# EAGLE design uC_Main 3 (EAGLE 8.5.0)
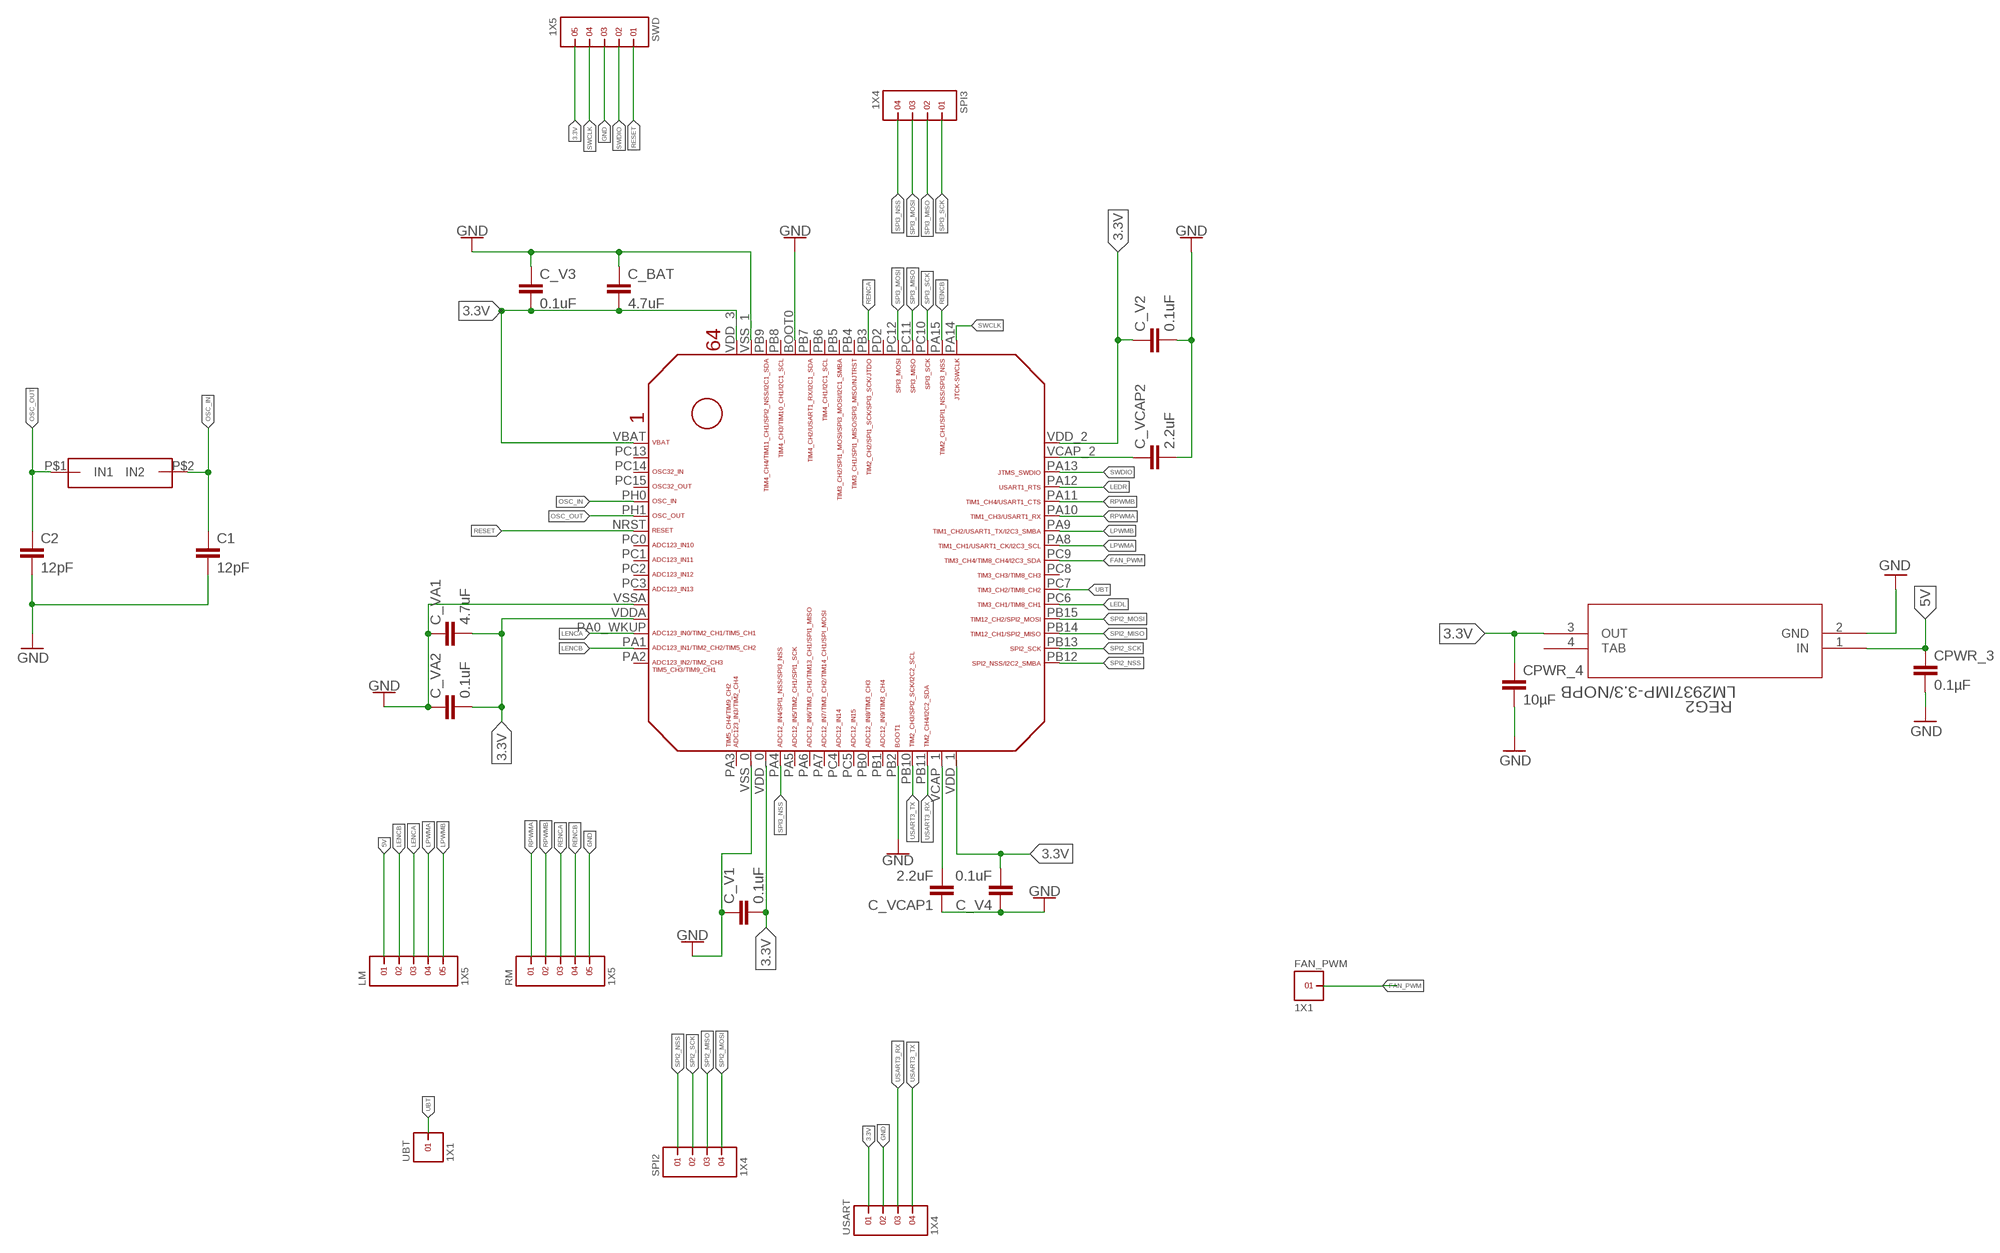
[diagram p0: schematic, sheet 1]

## Parts
C1  12pF  22PF-0603-50V-5%  [0603]
C2  12pF  22PF-0603-50V-5%  [0603]
C_BAT  4.7uF  22UF-0805-6.3V-20%  [0805@1]
C_V1  0.1uF  22UF-0805-6.3V-20%  [0805@1]
C_V2  0.1uF  22UF-0805-6.3V-20%  [0805@1]
C_V3  0.1uF  22UF-0805-6.3V-20%  [0805@1]
C_V4  0.1uF  22UF-0805-6.3V-20%  [0805@1]
C_VA1  4.7uF  22UF-0805-6.3V-20%  [0805@1]
C_VA2  0.1uF  22UF-0805-6.3V-20%  [0805@1]
C_VCAP1  2.2uF  22UF-0805-6.3V-20%  [0805@1]
C_VCAP2  2.2uF  22UF-0805-6.3V-20%  [0805@1]
CPWR_3  0.1µF  0.33UF/330NF-0805-50V-10%  [0805]
CPWR_4  10µF  0.33UF/330NF-0805-50V-10%  [0805]
FAN_PWM  1X1  [1X1]
LM  1X5  [1X5]
REG2  LM2937IMP-3.3/NOPB  [MP04A]
RM  1X5  [1X5]
SPI2  1X4  [1X4]
SPI3  1X4  [1X4]
SWD  1X5  [1X5]
U$1  STM32F405/415_LQFP64  [STM32F405/415_LQFP64]
U$2  OSC  [OSC]
UBT  1X1  [1X1]
USART  1X4  [1X4]

## Nets
3.3V: C_BAT.2 C_V1.2 C_V2.1 C_V3.2 C_V4.2 C_VA1.2 C_VA2.2 CPWR_4.1 REG2.3(OUT) SWD.5 U$1.VBAT U$1.VDD_0 U$1.VDD_1 U$1.VDD_2 U$1.VDD_3 U$1.VDDA USART.1
5V: CPWR_3.1 LM.1 REG2.1(IN)
FAN_PWM: FAN_PWM.1 U$1.PC9
GND: C1.2 C2.2 C_BAT.1 C_V1.1 C_V2.2 C_V3.1 C_V4.1 C_VA1.1 C_VA2.1 C_VCAP1.1 C_VCAP2.2 CPWR_3.2 CPWR_4.2 REG2.2(GND) RM.5 SWD.3 U$1.BOOT0 U$1.PB2 U$1.VSS_0 U$1.VSS_1 U$1.VSSA USART.2
LEDL: U$1.PC6
LEDR: U$1.PA12
LENCA: LM.3 U$1.PA0_WKUP(PA0_AKUP)
LENCB: LM.2 U$1.PA1
LPWMA: LM.4 U$1.PA8
LPWMB: LM.5 U$1.PA9
OSC_IN: C1.1 U$1.PH0 U$2.P$2(IN2)
OSC_OUT: C2.1 U$1.PH1 U$2.P$1(IN1)
RENCA: RM.3 U$1.PB3
RENCB: RM.4 U$1.PA15
RESET: SWD.1 U$1.NRST
RPWMA: RM.1 U$1.PA10
RPWMB: RM.2 U$1.PA11
SPI2_MISO: SPI2.3 U$1.PB14
SPI2_MOSI: SPI2.4 U$1.PB15
SPI2_NSS: SPI2.1 U$1.PB12
SPI2_SCK: SPI2.2 U$1.PB13
SPI3_MISO: SPI3.2 U$1.PC11
SPI3_MOSI: SPI3.3 U$1.PC12
SPI3_NSS: SPI3.4 U$1.PA4
SPI3_SCK: SPI3.1 U$1.PC10
SWCLK: SWD.4 U$1.PA14
SWDIO: SWD.2 U$1.PA13
UBT: U$1.PC7 UBT.1
USART3_RX: U$1.PB11 USART.3
USART3_TX: U$1.PB10 USART.4
VCAP_1: C_VCAP1.2 U$1.VCAP_1
VCAP_2: C_VCAP2.1 U$1.VCAP_2
Unconnected: U$1.PA2 U$1.PA3 U$1.PA5 U$1.PA6 U$1.PA7 U$1.PB0 U$1.PB1 U$1.PB4 U$1.PB5 U$1.PB6 U$1.PB7 U$1.PB8 U$1.PB9 U$1.PC0 U$1.PC1 U$1.PC2 U$1.PC3 U$1.PC4 U$1.PC5 U$1.PC8 U$1.PC13 U$1.PC14 U$1.PC15 U$1.PD2

## Power pins joined to a net without a drawn wire
TAB: REG2.4(TAB)

## Library data of the parts
C1 C2 = SparkFun-Capacitors:22PF: 22pF ceramic capacitors A capacitor is a passive two-terminal electrical component used to store electrical energy temporarily in an electric field.; PROD_ID: CAP-07876; VALUE: 22pF
C_BAT C_V1-C_V4 C_VA1 C_VA2 C_VCAP1 C_VCAP2 = SparkFun-Capacitors:22UF: 22µF ceramic capacitors A capacitor is a passive two-terminal electrical component used to store electrical energy temporarily in an electric field.; PROD_ID: CAP-08402; VALUE: 22uF
CPWR_3 CPWR_4 = SparkFun-Capacitors:0.33UF/330NF: 0.33¦ÌF/330nF ceramic capacitors A capacitor is a passive two-terminal electrical component used to store electrical energy temporarily in an electric field.; PROD_ID: CAP-08469; VALUE: 0.33¦ÌF
FAN_PWM UBT = headers(2mm):1X1
LM RM SWD = headers(2mm):1X5
REG2 = LM2937IMP-3.3:LM2937IMP-3.3/NOPB; COPYRIGHT: Copyright C 2015 Accelerated Designs. All rights reserved; MANUFACTURER_PART_NUMBER: lm2937imp3_3nopb; VENDOR: National Semiconductor
SPI2 SPI3 USART = headers(2mm):1X4
U$1 = STM32F405RG:STM32F405/415_LQFP64
U$2 = Cristal Oscillator:OSC

## Board
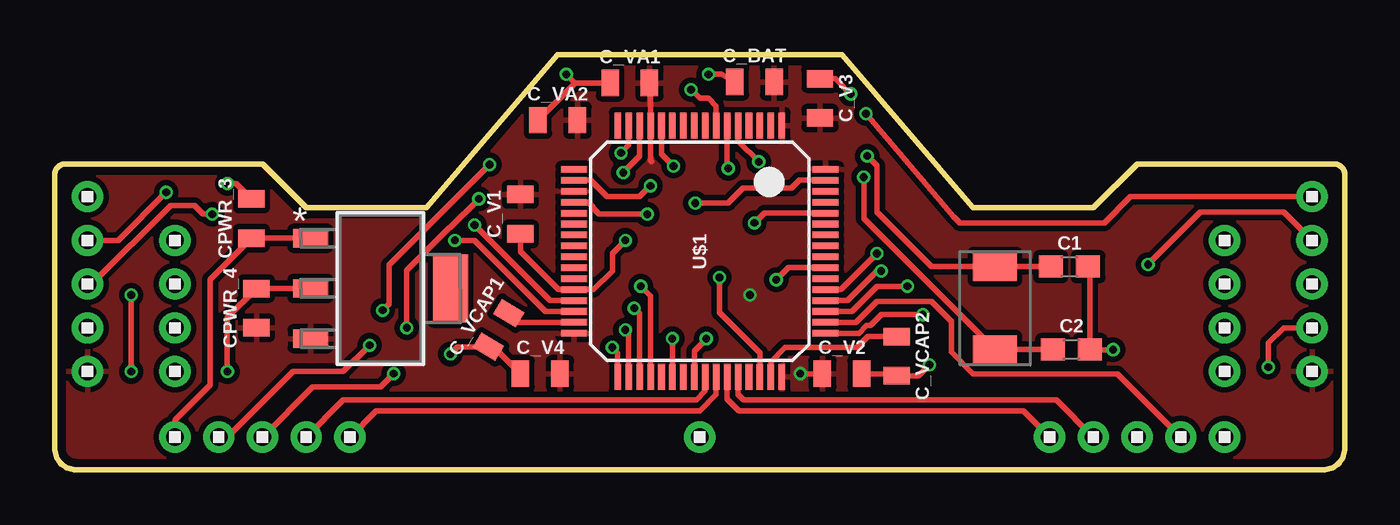
[diagram p1: board, top side]
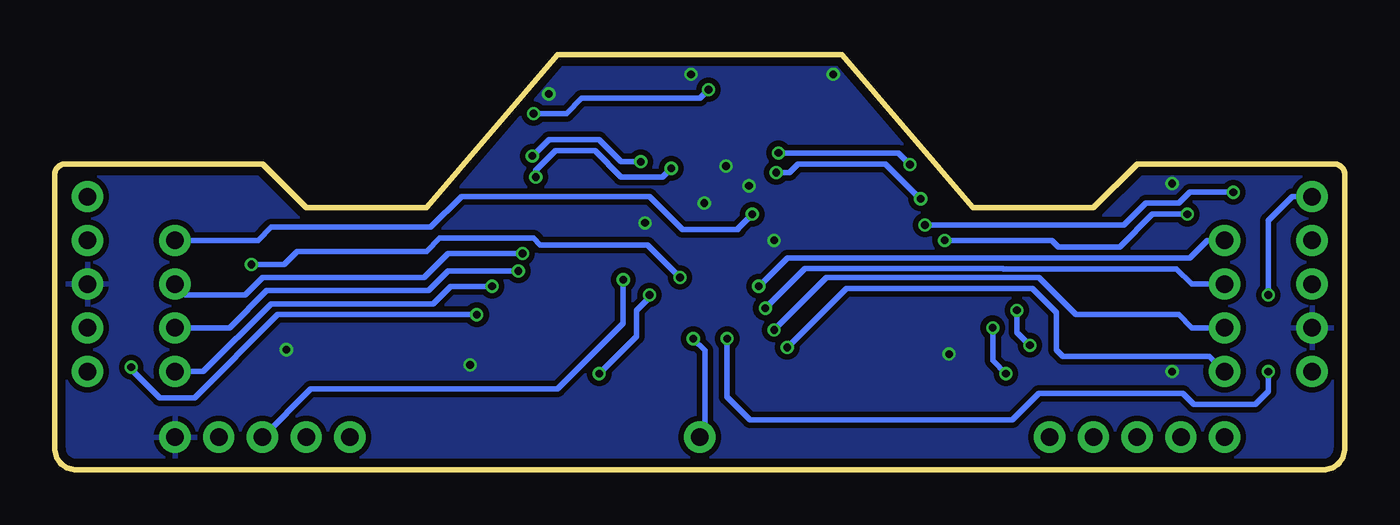
[diagram p2: board, bottom side, seen from below]

Size 59 x 19 mm. Coordinates in mm from the lower left corner, seen from the top.
Outline: 0.9,0 1,0
Outline: 1,0 58,0 arc90 59,1 59,13.5 arc90 58.5,14 49.5,14 47.5,12 42,12 36,19 23,19 17,12 11.5,12 9.5,14 0.5,14 arc90 0,13.5 0,1 arc90 1,0
Copper layers (1*16): Top 0.035559375mm / dielectric 1.6mm / Bottom 0.035559375mm
Design rules "oshpark-2layer *": minimum track width 6mil, minimum drill 10mil, track to track 6mil, track to pad 6mil, pad to pad 6mil, via to via 6mil, smd to smd 6mil, copper to edge 15mil, drill to drill 6mil, minimum pad ring 5mil, minimum via ring 5mil, stop-mask expansion 0mil, vias tented up to drill 12mil, thermal gap 10mil

### Footprints (pad centres in the part's own frame; a part is rotated, then mirrored left to right if it is on the bottom)
0603 = smd 1.1 x 1: 1 -0.85,0; 2 0.85,0
0805@1 = smd 0.8 x 1.2: 1 -0.9,0; 2 0.9,0
0805 = smd 0.8 x 1.2: 1 -0.9,0; 2 0.9,0
1X1 = drill 0.8 pad 1.422: 1 0,0
1X5 = drill 0.8 pad 1.422: 1 -4,0; 2 -2,0; 3 0,0; 4 2,0; 5 4,0
MP04A = smd 1.6 x 0.838: 1 -3.2,2.3; 2 -3.2,0; 3 -3.2,-2.3 | smd 1.6 x 3.099: 4 3.2,0
1X4 = drill 0.8 pad 1.422: 1 -3,0; 2 -1,0; 3 1,0; 4 3,0
STM32F405/415_LQFP64 = smd 0.3 x 1.2: BOOT0 -1.75,5.75; PA3 -3.75,-5.75; PA4 -2.25,-5.75; PA5 -1.75,-5.75; PA6 -1.25,-5.75; PA7 -0.75,-5.75; PA14 3.75,5.75; PA15 3.25,5.75; PB0 0.75,-5.75; PB1 1.25,-5.75; PB2 1.75,-5.75; PB3 0.75,5.75; PB4 0.25,5.75; PB5 -0.25,5.75; PB6 -0.75,5.75; PB7 -1.25,5.75; PB8 -2.25,5.75; PB9 -2.75,5.75; PB10 2.25,-5.75; PB11 2.75,-5.75; PC4 -0.25,-5.75; PC5 0.25,-5.75; PC10 2.75,5.75; PC11 2.25,5.75; PC12 1.75,5.75; PD2 1.25,5.75; VCAP_1 3.25,-5.75; VDD_0 -2.75,-5.75; VDD_1 3.75,-5.75; VDD_3 -3.75,5.75; VSS_0 -3.25,-5.75; VSS_1 -3.25,5.75 | smd 1.2 x 0.3: NRST -5.75,0.75; PA0_WKUP -5.75,-2.75; PA1 -5.75,-3.25; PA2 -5.75,-3.75; PA8 5.75,0.25; PA9 5.75,0.75; PA10 5.75,1.25; PA11 5.75,1.75; PA12 5.75,2.25; PA13 5.75,2.75; PB12 5.75,-3.75; PB13 5.75,-3.25; PB14 5.75,-2.75; PB15 5.75,-2.25; PC0 -5.75,0.25; PC1 -5.75,-0.25; PC2 -5.75,-0.75; PC3 -5.75,-1.25; PC6 5.75,-1.75; PC7 5.75,-1.25; PC8 5.75,-0.75; PC9 5.75,-0.25; PC13 -5.75,3.25; PC14 -5.75,2.75; PC15 -5.75,2.25; PH0 -5.75,1.75; PH1 -5.75,1.25; VBAT -5.75,3.75; VCAP_2 5.75,3.25; VDD_2 5.75,3.75; VDDA -5.75,-2.25; VSSA -5.75,-1.75
OSC = smd 1.3 x 2: P$1 0,0.1; P$2 3.8,0.1

### Placement (x,y rotation side)
C1  46.4,9.3 0 top
C2  46.5,5.51 0 top
C_BAT  32,17.75 0 top
C_V1  21.3,11.7 90 top
C_V2  36,4.4 0 top
C_V3  35,17 270 top
C_V4  22.2,4.4 0 top
C_VA1  26.3,17.7 0 top
C_VA2  23,16 0 top
C_VCAP1  20.3,6.4 58.6 top
C_VCAP2  38.5,5.2 270 top
CPWR_3  9,11.5 90 top
CPWR_4  9.23,7.4 90 top
FAN_PWM  29.5,1.5 0 top
LM  9.5,1.5 0 top
REG2  14.9,8.3 0 top
RM  49.5,1.5 0 top
SPI2  5.5,7.5 90 top
SPI3  53.5,7.5 90 top
SWD  57.5,8.5 270 top
U$1  29.5,10 270 top
U$2  43.1,5.5 90 top
UBT  1.5,12.5 0 top
USART  1.5,7.5 90 top

### Tracks (layer width: path | path; a pad name or v marks a point on that pad's centre or on a via)
3.3V  (via drill 0.35)
  Top 0.254: C_VA1.2 27.25,17.35 U$1.VDDA 27.25,14.15 27.3,14.1 | C_V2.1 v34.1,4.4
  Bottom 0.254: v34.1,4.4 32.4,6.1 32.4,7.3 31.8,7.9 v31.8,8
  pour Top (isolate 0.254): -17.5,32.5 -17.5,-17.5 -12.5,-22.5 64.5,-22.5 68.5,-18.5 68.5,27.5 62,34 -16,34
5V
  Top 0.254: LM.1 5.5,2.3 7.1,3.9 7.1,8.7 CPWR_3.1 REG2.1
FAN_PWM  (via drill 0.35)
  Top 0.254: U$1.PC9 29.25,5.45 v29.8,6
  Bottom 0.254: FAN_PWM.1 29.5,1.95 29.26,2.19 29.26,5.46 v29.8,6
GND  (via drill 0.35)
  Top 0.254: C_V1.1 21.3,9.99 23.04,8.25 U$1.PB2 24.65,8.25 25.5,9.1 25.5,9.9 v26.1,10.5 | C_VA1.1 23.8,17.7 | 23.8,17.7 C_VA2.1 | 23.8,17.7 v23.4,18.1 | C_BAT.1 30.5,18.1 v29.9,18.1 | v18.1,5.3 18.43,5.63 C_VCAP1.1 20.07,5.63 C_V4.1 | U$1.BOOT0 32.45,11.75 v32,11.3 | C_V3.1 35.7,17.9 v36.4,17.2 | U$1.VSSA 27.75,14.45 v28.3,13.9 | C_V2.2 38.4,4.4 C_VCAP2.2 39.5,4.3 v40,4.8 | U$1.VSS_1 34.05,13.25 33.7,12.9 31.47,12.9 30.78,12.21 v29.29,12.21 | C1.2 47.35,9.2 C2.2 47.36,5.5 v48.4,5.5 | U$1.VSS_0 24.5,13.25 25.25,12.5 26.75,12.5 v27.25,13 | v7.9,4.5 7.9,6.97 CPWR_4.2 11.6,8.3 REG2.2 | REG2.2 | CPWR_3.2 8.3,13.1 v7.9,13.1 | REG2.2
  pour Bottom (isolate 0.254): -14,-20 -10,-24 58,-24 65,-17 65,30 64,31 -13.5,31 -14,30.5
LENCA  (via drill 0.35)
  Top 0.254: v26,13.6 26.75,14.35 U$1.PA0_WKUP | v19.4,12.4 18.08,11.08 18.06,11.08 16.1,9.12 v16.1,6.5 | v15.5,4.4 14.9,3.8 11.8,3.8 LM.3
  Bottom 0.254: v26,13.6 25.4,13.6 25,14 21,14 v19.4,12.4 | v16.1,6.5 16.1,5 v15.5,4.4
LENCB  (via drill 0.35)
  Top 0.254: v25.9,14.5 26.25,14.85 U$1.PA1 | LM.2 7.9,1.5 10.9,4.5 13.2,4.5 v14.4,5.7 | v15,7.3 15.3,7.6 15.3,9.38 v19.89,13.97
  Bottom 0.254: v25.9,14.5 20.42,14.5 v19.89,13.97 | v15,7.3 15,6.3 v14.4,5.7
LPWMA
  Top 0.254: U$1.PA8 29.75,3.6 29.35,3.2 13.2,3.2 LM.4
LPWMB
  Top 0.254: U$1.PA9 30.25,3.45 29.5,2.7 14.7,2.7 LM.5
OSC_IN  (via drill 0.35)
  Top 0.254: 42,9.3 U$2.P$2 C1.1 | v32.2,14.1 31.25,15.05 U$1.PH0 | 42,9.3 40.1,9.3 37.6,11.8 37.6,13.92 v37.16,14.36 | 42,9.3
  Bottom 0.254: v32.2,14.1 33.1,14.1 34.1,15.1 36.4,15.1 37.14,14.36 v37.16,14.36
OSC_OUT  (via drill 0.35)
  Top 0.254: C2.1 45.64,5.5 U$2.P$1 37,11.5 v37,13.4 | v30.8,13.8 30.75,13.85 U$1.PH1
  Bottom 0.254: v30.8,13.8 31.2,13.4 33.1,13.4 34.3,14.6 36.1,14.6 37,13.7 v37,13.4
RENCA  (via drill 0.35)
  Top 0.254: U$1.PB3 33.55,9.25 v33,8.7
  Bottom 0.254: v33,8.7 33,6.7 36,3.7 47.3,3.7 RM.3
RENCB
  Top 0.254: U$1.PA15 36.65,6.75 37.6,7.7 40.1,7.7 41,6.8 41,5.4 42,4.4 48.6,4.4 RM.4
RESET  (via drill 0.35)
  Top 0.254: U$1.NRST 30.25,16.65 29.9,17 29.5,17 v29.1,17.4 | v37.1,16.3 41.1,11.6 41.4,11.3 48,11.3 49.2,12.5 SWD.1
  Bottom 0.254: v29.1,17.4 29.5,17 34.9,17 35.6,16.3 v37.1,16.3
RPWMA
  Top 0.254: U$1.PA10 30.75,3.25 31.3,2.7 44.3,2.7 RM.1
RPWMB
  Top 0.254: U$1.PA11 31.25,3.45 31.5,3.2 45.8,3.2 RM.2
SPI2_MISO  (via drill 0.35)
  Top 0.254: U$1.PB14 26.75,7.15 v26.5,7.4
  Bottom 0.254: v26.5,7.4 24.69,9.21 15.63,9.21 15.62,9.2 7.7,9.2 7,8.5 SPI2.3
SPI2_MOSI  (via drill 0.35)
  Top 0.254: U$1.PB15 27.25,7.95 v26.8,8.4
  Bottom 0.254: v26.8,8.4 25.5,9.7 7.1,9.7 6.3,10.5 SPI2.4
SPI2_NSS  (via drill 0.35)
  Top 0.254: U$1.PB12 25.75,5.35 v25.5,5.6
  Bottom 0.254: v25.5,5.6 22.8,8.3 14.3,8.3 13.2,7.2 13.2,5.5 12.9,5.2 6.2,5.2 SPI2.1
SPI2_SCK  (via drill 0.35)
  Top 0.254: U$1.PB13 26.25,6.25 v26.1,6.4
  Bottom 0.254: v26.1,6.4 23.7,8.8 15.8,8.8 15.79,8.79 13.99,8.79 12.3,7.1 7.6,7.1 7,6.5 SPI2.2
SPI3_MISO  (via drill 0.35)
  Top 0.254: U$1.PC11 36.25,7.75 37.6,9.1 v37.8,9.1
  Bottom 0.254: SPI3.2 51,6.5 49.3,8.2 41.9,8.2 41,9.1 v37.8,9.1
SPI3_MOSI  (via drill 0.35)
  Top 0.254: U$1.PC12 35.95,8.25 v37.6,9.9
  Bottom 0.254: v37.6,9.9 41,9.9 42.1,8.8 49.5,8.8 50.3,8 53,8 SPI3.3
SPI3_NSS  (via drill 0.35)
  Top 0.254: U$1.PA4 24.4,12.25 24.63,12.02 24.63,11.97 24.9,11.7 v27.1,11.7
  Bottom 0.254: SPI3.4 49.7,10.5 49.1,11.1 41.8,11.1 40.4,12.5 31.8,12.5 30.3,11 27.75,11 27.75,11.05 v27.1,11.7
SPI3_SCK  (via drill 0.35)
  Top 0.254: U$1.PC10 36.45,7.25 37.6,8.4 v39,8.4
  Bottom 0.254: SPI3.1 52.2,4.5 49.1,7.6 41.7,7.6 40.9,8.4 v39,8.4
SWCLK  (via drill 0.35)
  Top 0.254: U$1.PA14 36.77,6.25 37.12,6.6 37.3,6.6 37.8,7.1 v39.7,7.1 | v55.5,4.7 55.5,5.8 56.2,6.5 SWD.4
  Bottom 0.254: v39.7,7.1 48.8,7.1 52.6,3.3 54.2,3.3 55.5,4.6 v55.5,4.7 | 57.4,6.5 SWD.4
SWDIO  (via drill 0.35)
  Top 0.254: U$1.PA13 32.25,5.35 30.4,7.2 v30.4,8.8 | v50,9.4 52.4,11.8 56.2,11.8 SWD.2
  Bottom 0.254: v30.4,8.8 31.9,10.3 36.8,10.3 37.1,10.6 41.4,10.6 42,10 47.9,10 48.5,9.4 v50,9.4
UBT  (via drill 0.35)
  Top 0.254: U$1.PC7 v28.25,6.01 | v3.5,4.5 v3.5,8
  Bottom 0.254: v28.25,6.01 28.25,3.35 27.2,2.3 15.2,2.3 14,3.5 7.4,3.5 6.9,3 4.1,3 3.5,3.6 v3.5,4.5 | UBT.1 2.4,12.5 3.5,11.4 v3.5,8
USART3_RX  (via drill 0.35)
  Top 0.254: U$1.PB11 22.45,7.25 19.2,10.5 v18.3,10.5 | v7.2,11.7 6.8,11.7 6.4,12.1 5.3,12.1 1.7,8.5 USART.3
  Bottom 0.254: v7.2,11.7 8.8,11.7 10.3,10.2 13.1,10.2 13.4,10.5 v18.3,10.5
USART3_TX  (via drill 0.35)
  Top 0.254: U$1.PB10 22.65,7.75 v19.2,11.2 | USART.4 2.9,10.5 v5.1,12.7
  Bottom 0.254: v19.2,11.2 10.1,11.2 9.1,12.2 7.6,12.2 7.1,12.7 v5.1,12.7
VCAP_1
  Top 0.254: U$1.VCAP_1 21.19,6.75 C_VCAP1.2
VCAP_2
  Top 0.254: U$1.VCAP_2 32.75,4.95 33.4,5.6 36.7,5.6 37.2,6.1 C_VCAP2.1